# Altium schematic sheet Sheet1.SchDoc
size A4
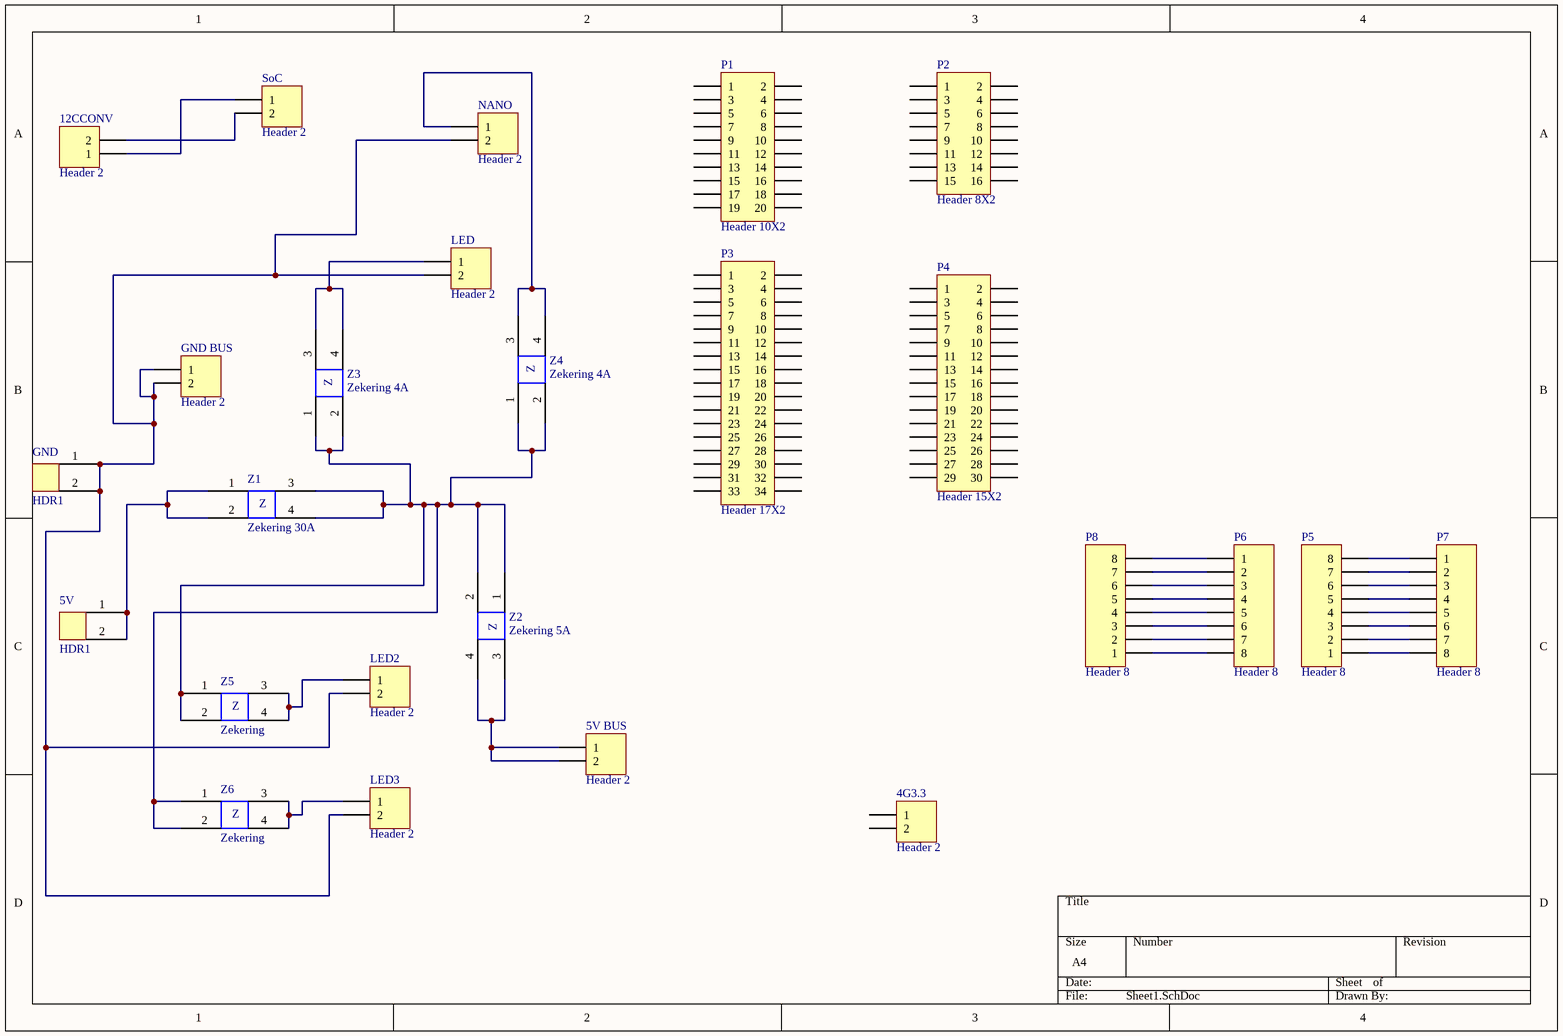
[diagram p0: Sheet1.SchDoc]

## Parts
4G3.3  Header 2  [HDR1X2]
5V  HDR1  [HDR1]
5V_BUS  Header 2  [HDR2]
12CCONV  Header 2  [HDR1X2]
GND  HDR1  [HDR1]
GND_BUS  Header 2  [HDR2]
LED  Header 2  [HDR2]
LED2  Header 2  [HDR2]
LED3  Header 2  [HDR2]
NANO  Header 2  [HDR1X2]
P1  Header 10X2  [hdr10x2]
P2  Header 8X2  [hdr8x2]
P3  Header 17X2  [hdr17x2]
P4  Header 15X2  [hdr15x2]
P5  Header 8  [HDR8]
P6  Header 8  [HDR8]
P7  Header 8  [HDR8]
P8  Header 8  [HDR8]
SoC  Header 2  [HDR1X2]
Z1  Zekering 30A  [Zekering]
Z2  Zekering 5A  [Zekering]
Z3  Zekering 4A  [Zekering]
Z4  Zekering 4A  [Zekering]
Z5  Zekering  [Zekering]
Z6  Zekering  [Zekering]

## Nets
Net5V_1: 5V.1 5V.2 Z1.1 Z1.2
Net5V_BUS_1: 5V_BUS.1 5V_BUS.2 Z2.3 Z2.4
Net12CCONV_1: 12CCONV.1 SoC.1
Net12CCONV_2: 12CCONV.2 SoC.2
NetGND_1: GND.1 GND.2 GND_BUS.1 GND_BUS.2 LED.2 LED2.2 LED3.2 NANO.2
NetLED2_1: LED2.1 Z5.3 Z5.4
NetLED3_1: LED3.1 Z6.3 Z6.4
NetLED_1: LED.1 Z3.3 Z3.4
NetNANO_1: NANO.1 Z4.3 Z4.4
NetP5_1: P5.1 P7.8
NetP5_2: P5.2 P7.7
NetP5_3: P5.3 P7.6
NetP5_4: P5.4 P7.5
NetP5_5: P5.5 P7.4
NetP5_6: P5.6 P7.3
NetP5_7: P5.7 P7.2
NetP5_8: P5.8 P7.1
NetP6_1: P6.1 P8.8
NetP6_2: P6.2 P8.7
NetP6_3: P6.3 P8.6
NetP6_4: P6.4 P8.5
NetP6_5: P6.5 P8.4
NetP6_6: P6.6 P8.3
NetP6_7: P6.7 P8.2
NetP6_8: P6.8 P8.1
NetZ1_3: Z1.3 Z1.4 Z2.1 Z2.2 Z3.1 Z3.2 Z4.1 Z4.2 Z5.1 Z5.2 Z6.1 Z6.2

Not connected (* = marked no-connect by the designer): 4G3.3 1 2; P1 1 2 3 4 5 6 7 8 9 10 11 12 13 14 15 16 17 18 19 20; P2 1 2 3 4 5 6 7 8 9 10 11 12 13 14 15 16; P3 1 2 3 4 5 6 7 8 9 10 11 12 13 14 15 16 17 18 19 20 21 22 23 24 25 26 27 28 29 30 31 32 33 34; P4 1 2 3 4 5 6 7 8 9 10 11 12 13 14 15 16 17 18 19 20 21 22 23 24 25 26 27 28 29 30

## Notes on the sheet
- (in symbol Zekering) Z

## Library data of the parts
4G3.3 5V_BUS 12CCONV GND_BUS LED LED2 LED3 NANO SoC = Header 2: Header, 2-Pin; LatestRevisionDate: 17-Jul-2002; LatestRevisionNote: Re-released for DXP Platform.; Publisher: Altium Limited
P1 = Header 10X2: Header, 10-Pin, Dual row; LatestRevisionDate: 17-Jul-2002; LatestRevisionNote: Re-released for DXP Platform.; Publisher: Altium Limited
P2 = Header 8X2: Header, 8-Pin, Dual row; LatestRevisionDate: 17-Jul-2002; LatestRevisionNote: Re-released for DXP Platform.; Publisher: Altium Limited
P3 = Header 17X2: Header, 17-Pin, Dual row; LatestRevisionDate: 17-Jul-2002; LatestRevisionNote: Re-released for DXP Platform.; Publisher: Altium Limited
P4 = Header 15X2: Header, 15-Pin, Dual row; LatestRevisionDate: 17-Jul-2002; LatestRevisionNote: Re-released for DXP Platform.; Publisher: Altium Limited
P5-P8 = Header 8: Header, 8-Pin; LatestRevisionDate: 17-Jul-2002; LatestRevisionNote: Re-released for DXP Platform.; Publisher: Altium Limited
Z1-Z4 = Zekering